# Altium project BMI088 I2C Breakout V1.0.PrjPcb
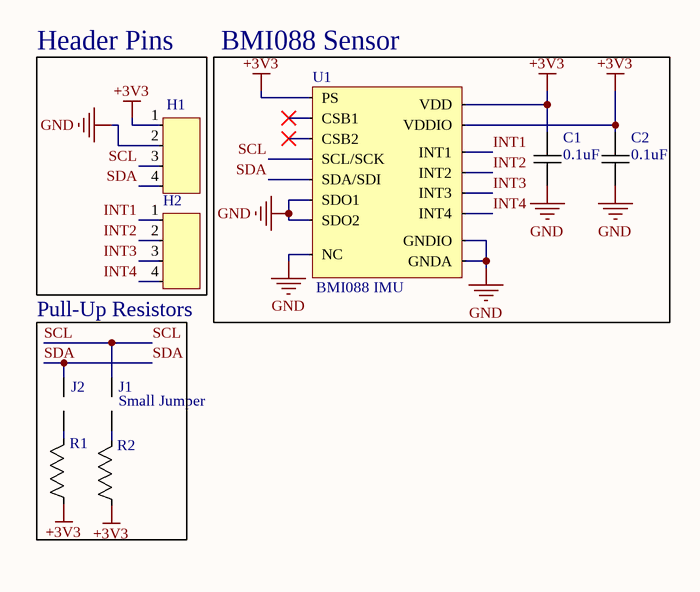
[diagram p0: BMI088 I2C Breakout V1.0 Schematic.SchDoc]
1 sheet, 9 parts. Net scope: global (net labels, ports and power ports of the same name join across sheets).
Board file: BMI088 I2C Breakout V1.0 PCB.PcbDoc

## Sheet BMI088 I2C Breakout V1.0 Schematic.SchDoc
size A; SheetNumber: 1; SheetTotal: 1

### Parts
C1  0.1uF  [CL10B104KB8NNWC 0.1uF 0603-Footprint-1]
C2  0.1uF  [CL10B104KB8NNWC 0.1uF 0603-Footprint-1]
H1  PR20204VBNN 4 Pin Male Header Pin 2.54mm  [PR20204VBNN 4 Pin Male Header Pin 2.54mm-Footprint-1]  (value not drawn)
H2  PR20204VBNN 4 Pin Male Header Pin 2.54mm  [PR20204VBNN 4 Pin Male Header Pin 2.54mm-Footprint-1]  (value not drawn)
J1  Small Jumper  [Small Jumper-Footprint-1]
J2  Small Jumper  [Small Jumper-Footprint-1]  (value not drawn)
R1  WR06X152 JTL 1.5K Ohm 0603  [WR06X152 JTL 1.5K Ohm 0603-Footprint-1]  (value not drawn)
R2  WR06X152 JTL 1.5K Ohm 0603  [WR06X152 JTL 1.5K Ohm 0603-Footprint-1]  (value not drawn)
U1  BMI088 IMU  [BMI088 IMU-Footprint-1]

### Blocks framed on the sheet
Header Pins: H1 H2
BMI088 Sensor: C1 C2 U1
Pull-Up Resistors: J1 J2 R1 R2

### Nets
+3V3: C1.2 C2.2 H1.1(X) R1.1 R2.1 U1.3(VDD) U1.7(PS) U1.11(VDDIO)
GND: C1.1 C2.1 H1.2(X) U1.2(NC) U1.4(GNDA) U1.6(GNDIO) U1.10(SDO2) U1.15(SDO1)
INT1: H2.1(X) U1.16(INT1)
INT2: H2.2(X) U1.1(INT2)
INT3: H2.3(X) U1.12(INT3)
INT4: H2.4(X) U1.13(INT4)
SCL: H1.3(X) J1.1 U1.8(SCL/SCK)
SDA: H1.4(X) J2.1 U1.9(SDA/SDI)
NetJ1_2: J1.2 R2.2
NetJ2_2: J2.2 R1.2

Not connected (* = marked no-connect by the designer): U1 5(CSB2)* 14(CSB1)*

### Library data of the parts
C1 C2 = CMP-00001-6: CL10B104KB8NNWC 0.1uF 0603 +-10% SMD; ComponentLink1URL: https://www.digikey.com/en/products/detail/samsung-electro-mechanics/CL10B104KB8NNWC/3887593; ComponentLink1Description: Supplier; Value: 0.1uF
H1 H2 = CMP-00002-5: PR20204VBNN 4 Pin Male Header Pin 2.54mm General Use; ComponentLink1URL: https://www.digikey.com/en/products/detail/metz-connect-usa-inc/PR20204VBNN/12342903?s=N4IgTCBcDaIIwA4AsBOADgJzABh0gbgEYB2xIAugL5A; ComponentLink1Description: Supplier
J1 J2 = CMP-00004-4: Small Jumper For Low Current And Voltage
R1 R2 = CMP-00003-4: WR06X152 JTL 1.5K Ohm 0603 +-5% SMD; ComponentLink1URL: https://www.digikey.com/en/products/detail/walsin-technology-corporation/WR06X152-JTL/13239040; ComponentLink1Description: Supplier; Value: 1.5K Ohm
U1 = CMP-00000-17: BMI088 IMU General Use; ComponentLink1URL: https://theflametrench.com/shop/bmi088-standalone-sensor; ComponentLink1Description: Supplier